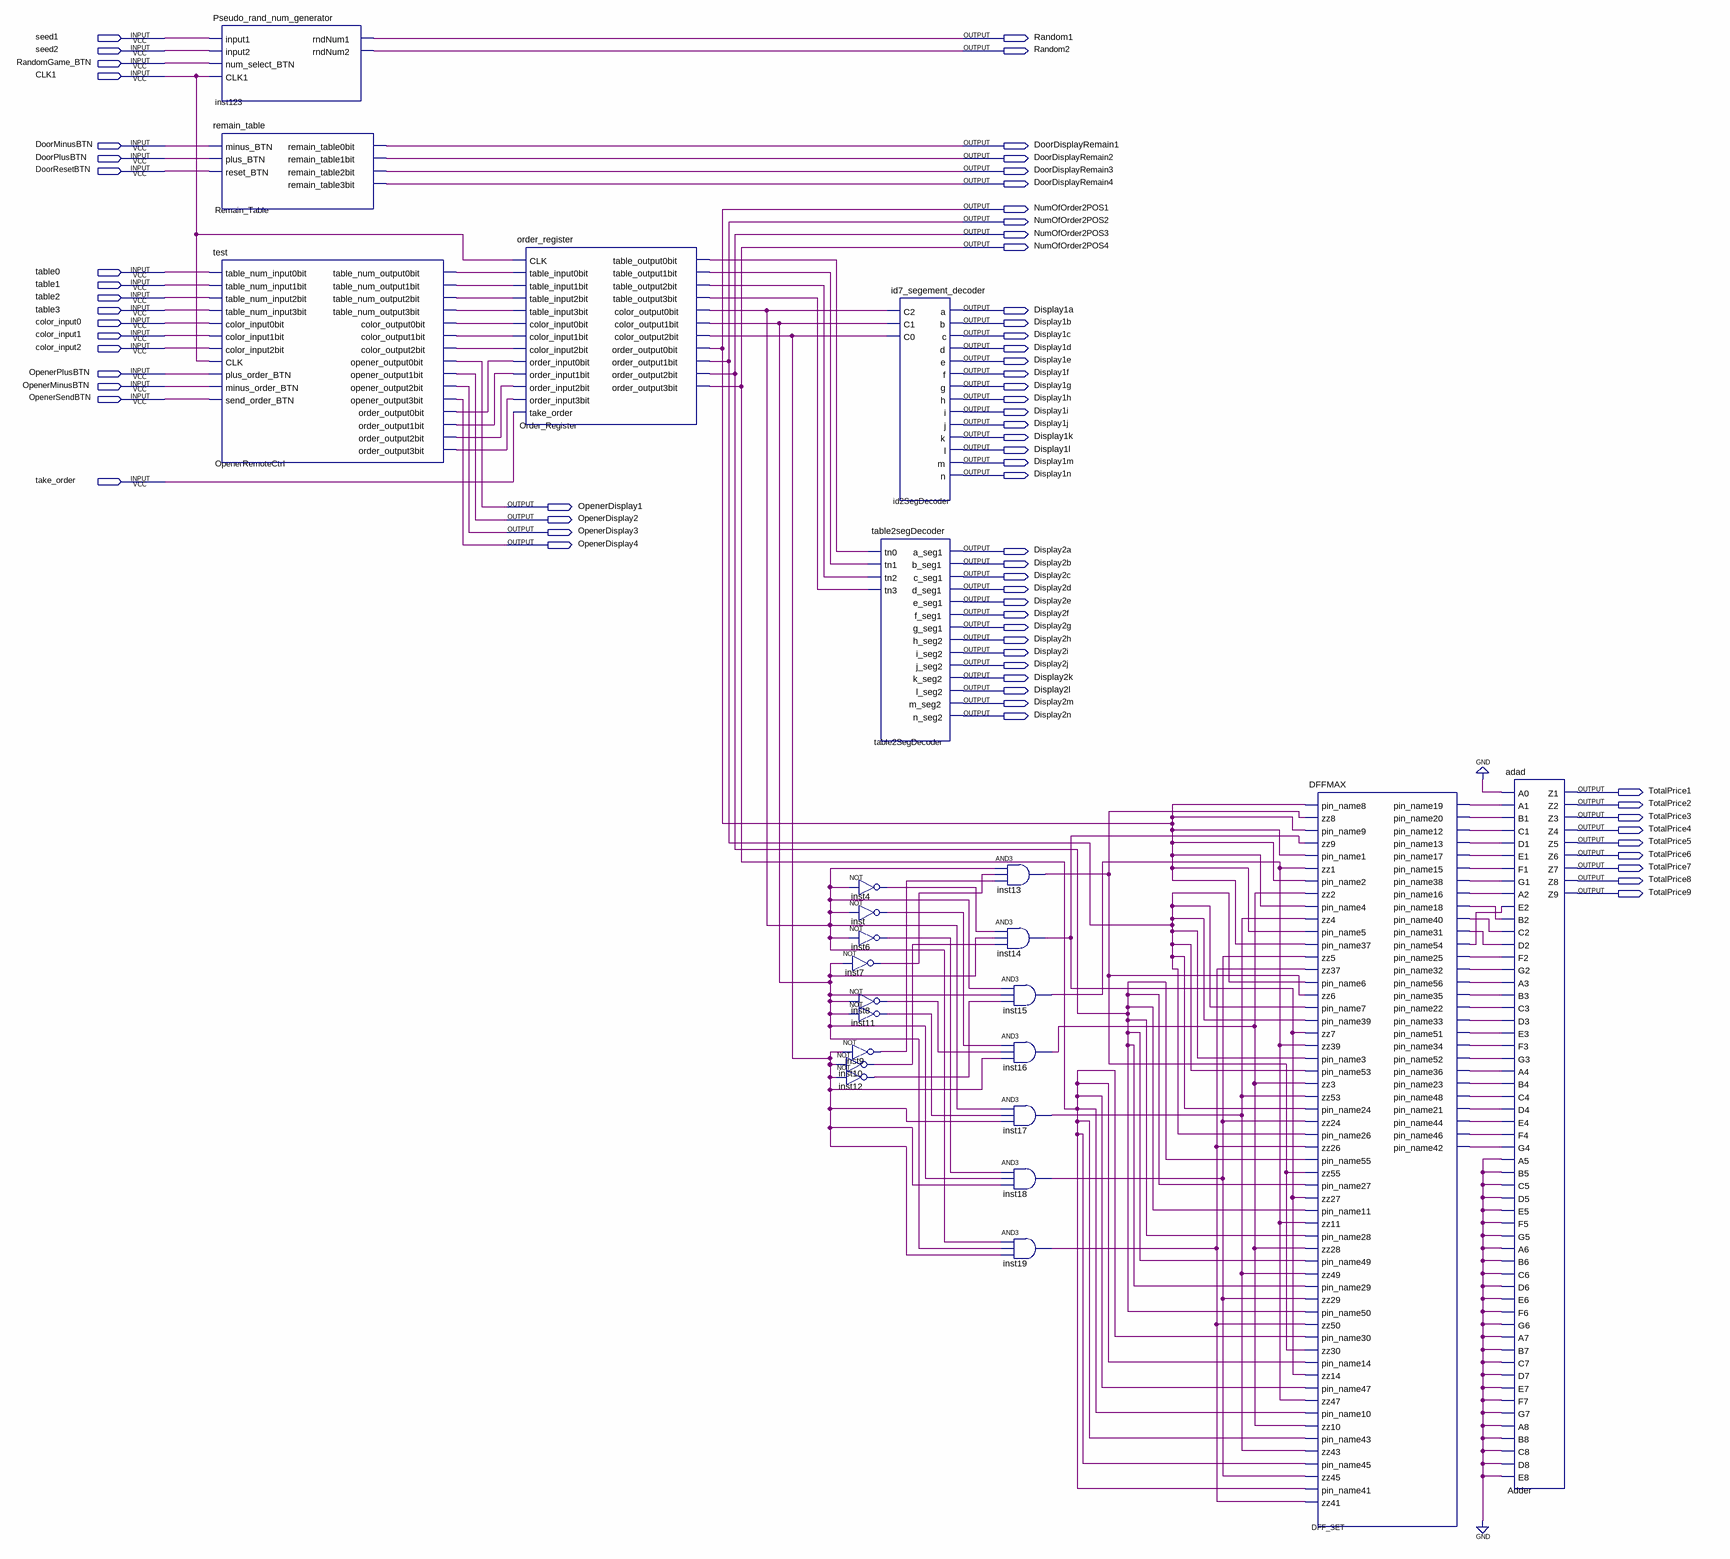
[diagram p0: schematic sheet]
// Quartus schematic AutomaticRestaurant.bdf as structural Verilog: 24 symbols, 69 pins
module AutomaticRestaurant (
  input  seed1,
  input  seed2,
  input  RandomGame_BTN,
  input  CLK1,
  input  DoorMinusBTN,
  input  DoorPlusBTN,
  input  DoorResetBTN,
  input  table0,
  input  table1,
  input  table2,
  input  table3,
  input  color_input0,
  input  color_input1,
  input  color_input2,
  input  OpenerPlusBTN,
  input  OpenerMinusBTN,
  input  OpenerSendBTN,
  input  take_order,
  output Random1,
  output Random2,
  output DoorDisplayRemain1,
  output DoorDisplayRemain2,
  output DoorDisplayRemain3,
  output DoorDisplayRemain4,
  output NumOfOrder2POS1,
  output NumOfOrder2POS2,
  output NumOfOrder2POS3,
  output NumOfOrder2POS4,
  output Display1a,
  output Display1b,
  output Display1c,
  output Display1d,
  output Display1e,
  output Display1f,
  output Display1g,
  output Display1h,
  output Display1i,
  output Display1j,
  output Display1k,
  output Display1l,
  output Display1m,
  output Display1n,
  output OpenerDisplay1,
  output OpenerDisplay2,
  output OpenerDisplay3,
  output OpenerDisplay4,
  output Display2a,
  output Display2b,
  output Display2c,
  output Display2d,
  output Display2e,
  output Display2f,
  output Display2g,
  output Display2h,
  output Display2i,
  output Display2j,
  output Display2k,
  output Display2l,
  output Display2m,
  output Display2n,
  output TotalPrice1,
  output TotalPrice2,
  output TotalPrice3,
  output TotalPrice4,
  output TotalPrice5,
  output TotalPrice6,
  output TotalPrice7,
  output TotalPrice8,
  output TotalPrice9
);

  wire DFF_SET_pin_name12, DFF_SET_pin_name13, DFF_SET_pin_name15, DFF_SET_pin_name16, DFF_SET_pin_name17,
       DFF_SET_pin_name18, DFF_SET_pin_name19, DFF_SET_pin_name20, DFF_SET_pin_name21, DFF_SET_pin_name22,
       DFF_SET_pin_name23, DFF_SET_pin_name25, DFF_SET_pin_name31, DFF_SET_pin_name32, DFF_SET_pin_name33,
       DFF_SET_pin_name34, DFF_SET_pin_name35, DFF_SET_pin_name36, DFF_SET_pin_name38, DFF_SET_pin_name40,
       DFF_SET_pin_name42, DFF_SET_pin_name44, DFF_SET_pin_name46, DFF_SET_pin_name48, DFF_SET_pin_name51,
       DFF_SET_pin_name52, DFF_SET_pin_name54, DFF_SET_pin_name56, inst4_out, inst6_out, inst7_out,
       inst8_out, inst9_out, inst10_out, inst11_out, inst12_out, inst13_out, inst14_out, inst15_out,
       inst16_out, inst17_out, inst18_out, inst19_out, inst_out, OpenerRemoteCtrl_color_output0bit,
       OpenerRemoteCtrl_color_output1bit, OpenerRemoteCtrl_color_output2bit,
       OpenerRemoteCtrl_order_output0bit, OpenerRemoteCtrl_order_output1bit,
       OpenerRemoteCtrl_order_output2bit, OpenerRemoteCtrl_order_output3bit,
       OpenerRemoteCtrl_table_num_output0bit, OpenerRemoteCtrl_table_num_output1bit,
       OpenerRemoteCtrl_table_num_output2bit, OpenerRemoteCtrl_table_num_output3bit,
       Order_Register_color_output0bit, Order_Register_color_output1bit, Order_Register_color_output2bit,
       Order_Register_table_output0bit, Order_Register_table_output1bit, Order_Register_table_output2bit,
       Order_Register_table_output3bit;

  Pseudo_rand_num_generator inst123 (
    .input1(seed1), .input2(seed2), .num_select_BTN(RandomGame_BTN), .CLK1(CLK1), .rndNum1(Random1),
    .rndNum2(Random2));
  remain_table Remain_Table (
    .minus_BTN(DoorMinusBTN), .plus_BTN(DoorPlusBTN), .reset_BTN(DoorResetBTN),
    .remain_table0bit(DoorDisplayRemain1), .remain_table1bit(DoorDisplayRemain2),
    .remain_table2bit(DoorDisplayRemain3), .remain_table3bit(DoorDisplayRemain4));
  test OpenerRemoteCtrl (
    .table_num_input0bit(table0), .table_num_input1bit(table1), .table_num_input2bit(table2),
    .table_num_input3bit(table3), .color_input0bit(color_input0), .color_input1bit(color_input1),
    .color_input2bit(color_input2), .CLK(CLK1), .plus_order_BTN(OpenerPlusBTN),
    .minus_order_BTN(OpenerMinusBTN), .send_order_BTN(OpenerSendBTN),
    .table_num_output0bit(OpenerRemoteCtrl_table_num_output0bit),
    .table_num_output1bit(OpenerRemoteCtrl_table_num_output1bit),
    .table_num_output2bit(OpenerRemoteCtrl_table_num_output2bit),
    .table_num_output3bit(OpenerRemoteCtrl_table_num_output3bit),
    .color_output0bit(OpenerRemoteCtrl_color_output0bit),
    .color_output1bit(OpenerRemoteCtrl_color_output1bit),
    .color_output2bit(OpenerRemoteCtrl_color_output2bit), .opener_output0bit(OpenerDisplay1),
    .opener_output1bit(OpenerDisplay2), .opener_output2bit(OpenerDisplay3),
    .opener_output3bit(OpenerDisplay4), .order_output0bit(OpenerRemoteCtrl_order_output0bit),
    .order_output1bit(OpenerRemoteCtrl_order_output1bit),
    .order_output2bit(OpenerRemoteCtrl_order_output2bit), .order_output3bit(OpenerRemoteCtrl_order_output3bit));
  order_register Order_Register (
    .CLK(CLK1), .table_input0bit(OpenerRemoteCtrl_table_num_output0bit),
    .table_input1bit(OpenerRemoteCtrl_table_num_output1bit),
    .table_input2bit(OpenerRemoteCtrl_table_num_output2bit),
    .table_input3bit(OpenerRemoteCtrl_table_num_output3bit),
    .color_input0bit(OpenerRemoteCtrl_color_output0bit), .color_input1bit(OpenerRemoteCtrl_color_output1bit),
    .color_input2bit(OpenerRemoteCtrl_color_output2bit), .order_input0bit(OpenerRemoteCtrl_order_output0bit),
    .order_input1bit(OpenerRemoteCtrl_order_output1bit), .order_input2bit(OpenerRemoteCtrl_order_output2bit),
    .order_input3bit(OpenerRemoteCtrl_order_output3bit), .take_order(take_order),
    .table_output0bit(Order_Register_table_output0bit), .table_output1bit(Order_Register_table_output1bit),
    .table_output2bit(Order_Register_table_output2bit), .table_output3bit(Order_Register_table_output3bit),
    .color_output0bit(Order_Register_color_output0bit), .color_output1bit(Order_Register_color_output1bit),
    .color_output2bit(Order_Register_color_output2bit), .order_output0bit(NumOfOrder2POS1),
    .order_output1bit(NumOfOrder2POS2), .order_output2bit(NumOfOrder2POS3), .order_output3bit(NumOfOrder2POS4));
  table2segDecoder table2SegDecoder (
    .tn0(Order_Register_table_output0bit), .tn1(Order_Register_table_output1bit),
    .tn2(Order_Register_table_output2bit), .tn3(Order_Register_table_output3bit), .a_seg1(Display2a),
    .b_seg1(Display2b), .c_seg1(Display2c), .d_seg1(Display2d), .e_seg1(Display2e), .f_seg1(Display2f),
    .g_seg1(Display2g), .h_seg2(Display2h), .i_seg2(Display2i), .j_seg2(Display2j), .k_seg2(Display2k),
    .l_seg2(Display2l), .m_seg2(Display2m), .n_seg2(Display2n));
  not inst4 (inst4_out, Order_Register_color_output0bit);
  not inst (inst_out, Order_Register_color_output0bit);
  not inst6 (inst6_out, Order_Register_color_output0bit);
  not inst7 (inst7_out, Order_Register_color_output1bit);
  not inst8 (inst8_out, Order_Register_color_output1bit);
  not inst11 (inst11_out, Order_Register_color_output1bit);
  not inst9 (inst9_out, Order_Register_color_output2bit);
  not inst10 (inst10_out, Order_Register_color_output2bit);
  not inst12 (inst12_out, Order_Register_color_output2bit);
  id7_segement_decoder id2SegDecoder (
    .C2(Order_Register_color_output0bit), .C1(Order_Register_color_output1bit),
    .C0(Order_Register_color_output2bit), .a(Display1a), .b(Display1b), .c(Display1c), .d(Display1d),
    .e(Display1e), .f(Display1f), .g(Display1g), .h(Display1h), .i(Display1i), .j(Display1j), .k(Display1k),
    .l(Display1l), .m(Display1m), .n(Display1n));
  and inst13 (inst13_out, Order_Register_color_output0bit, inst7_out, inst9_out);
  and inst14 (inst14_out, inst4_out, Order_Register_color_output1bit, inst10_out);
  and inst15 (inst15_out, Order_Register_color_output0bit, Order_Register_color_output1bit, inst12_out);
  and inst16 (inst16_out, inst_out, inst8_out, Order_Register_color_output2bit);
  and inst17 (inst17_out, Order_Register_color_output0bit, inst11_out, Order_Register_color_output2bit);
  and inst18 (inst18_out, inst6_out, Order_Register_color_output1bit, Order_Register_color_output2bit);
  and inst19 (inst19_out, Order_Register_color_output0bit, Order_Register_color_output1bit, Order_Register_color_output2bit);
  DFFMAX DFF_SET (
    .pin_name8(NumOfOrder2POS1), .zz8(inst13_out), .pin_name9(NumOfOrder2POS1), .zz9(inst14_out),
    .pin_name1(NumOfOrder2POS1), .zz1(inst15_out), .pin_name2(NumOfOrder2POS1), .zz2(inst16_out),
    .pin_name4(NumOfOrder2POS1), .zz4(inst17_out), .pin_name5(NumOfOrder2POS1), .pin_name37(NumOfOrder2POS1),
    .zz5(inst18_out), .zz37(inst19_out), .pin_name6(NumOfOrder2POS2), .zz6(inst13_out),
    .pin_name7(NumOfOrder2POS2), .pin_name39(NumOfOrder2POS2), .zz7(inst14_out), .zz39(inst15_out),
    .pin_name3(NumOfOrder2POS2), .pin_name53(NumOfOrder2POS2), .zz3(inst16_out), .zz53(inst17_out),
    .pin_name24(NumOfOrder2POS2), .zz24(inst18_out), .pin_name26(NumOfOrder2POS2), .zz26(inst19_out),
    .pin_name55(NumOfOrder2POS3), .zz55(inst13_out), .pin_name27(NumOfOrder2POS3), .zz27(inst14_out),
    .pin_name11(NumOfOrder2POS3), .zz11(inst15_out), .pin_name28(NumOfOrder2POS3), .zz28(inst16_out),
    .pin_name49(NumOfOrder2POS3), .zz49(inst17_out), .pin_name29(NumOfOrder2POS3), .zz29(inst18_out),
    .pin_name50(NumOfOrder2POS3), .zz50(inst19_out), .pin_name30(NumOfOrder2POS4), .zz30(inst13_out),
    .pin_name14(NumOfOrder2POS4), .zz14(inst14_out), .pin_name47(NumOfOrder2POS4), .zz47(inst15_out),
    .pin_name10(NumOfOrder2POS4), .zz10(inst16_out), .pin_name43(NumOfOrder2POS4), .zz43(inst17_out),
    .pin_name45(NumOfOrder2POS4), .zz45(inst18_out), .pin_name41(NumOfOrder2POS4), .zz41(inst19_out),
    .pin_name19(DFF_SET_pin_name19), .pin_name20(DFF_SET_pin_name20), .pin_name12(DFF_SET_pin_name12),
    .pin_name13(DFF_SET_pin_name13), .pin_name17(DFF_SET_pin_name17), .pin_name15(DFF_SET_pin_name15),
    .pin_name38(DFF_SET_pin_name38), .pin_name16(DFF_SET_pin_name16), .pin_name18(DFF_SET_pin_name18),
    .pin_name40(DFF_SET_pin_name40), .pin_name31(DFF_SET_pin_name31), .pin_name54(DFF_SET_pin_name54),
    .pin_name25(DFF_SET_pin_name25), .pin_name32(DFF_SET_pin_name32), .pin_name56(DFF_SET_pin_name56),
    .pin_name35(DFF_SET_pin_name35), .pin_name22(DFF_SET_pin_name22), .pin_name33(DFF_SET_pin_name33),
    .pin_name51(DFF_SET_pin_name51), .pin_name34(DFF_SET_pin_name34), .pin_name52(DFF_SET_pin_name52),
    .pin_name36(DFF_SET_pin_name36), .pin_name23(DFF_SET_pin_name23), .pin_name48(DFF_SET_pin_name48),
    .pin_name21(DFF_SET_pin_name21), .pin_name44(DFF_SET_pin_name44), .pin_name46(DFF_SET_pin_name46),
    .pin_name42(DFF_SET_pin_name42));
  adad Adder (
    .A0(1'b0), .A1(DFF_SET_pin_name19), .B1(DFF_SET_pin_name20), .C1(DFF_SET_pin_name12),
    .D1(DFF_SET_pin_name13), .E1(DFF_SET_pin_name17), .F1(DFF_SET_pin_name15), .G1(DFF_SET_pin_name38),
    .A2(DFF_SET_pin_name16), .E2(DFF_SET_pin_name54), .B2(DFF_SET_pin_name18), .C2(DFF_SET_pin_name40),
    .D2(DFF_SET_pin_name31), .F2(DFF_SET_pin_name25), .G2(DFF_SET_pin_name32), .A3(DFF_SET_pin_name56),
    .B3(DFF_SET_pin_name35), .C3(DFF_SET_pin_name22), .D3(DFF_SET_pin_name33), .E3(DFF_SET_pin_name51),
    .F3(DFF_SET_pin_name34), .G3(DFF_SET_pin_name52), .A4(DFF_SET_pin_name36), .B4(DFF_SET_pin_name23),
    .C4(DFF_SET_pin_name48), .D4(DFF_SET_pin_name21), .E4(DFF_SET_pin_name44), .F4(DFF_SET_pin_name46),
    .G4(DFF_SET_pin_name42), .A5(1'b0), .B5(1'b0), .C5(1'b0), .D5(1'b0), .E5(1'b0), .F5(1'b0), .G5(1'b0),
    .A6(1'b0), .B6(1'b0), .C6(1'b0), .D6(1'b0), .E6(1'b0), .F6(1'b0), .G6(1'b0), .A7(1'b0), .B7(1'b0),
    .C7(1'b0), .D7(1'b0), .E7(1'b0), .F7(1'b0), .G7(1'b0), .A8(1'b0), .B8(1'b0), .C8(1'b0), .D8(1'b0),
    .E8(1'b0), .Z1(TotalPrice1), .Z2(TotalPrice2), .Z3(TotalPrice3), .Z4(TotalPrice4), .Z5(TotalPrice5),
    .Z6(TotalPrice6), .Z7(TotalPrice7), .Z8(TotalPrice8), .Z9(TotalPrice9));
endmodule
